# Altium project Engineering_project_DC_power_supply.PrjPcb
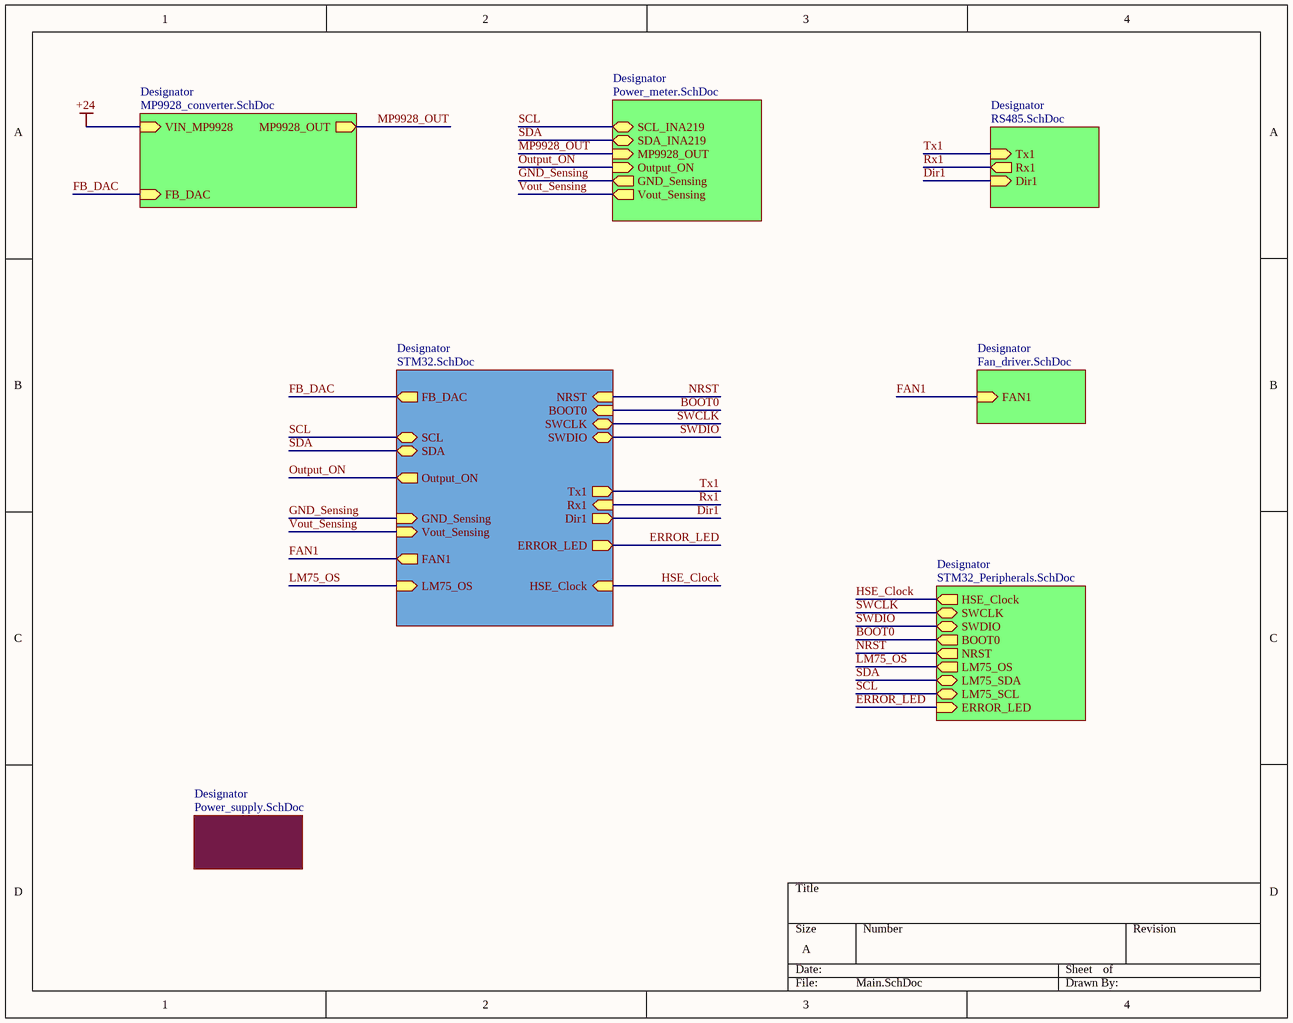
[diagram p0: Main.SchDoc]
8 sheets, 138 parts. Net scope: hierarchical (ports join the sheet entries above them; power ports are global).
Board file: PCB1.PcbDoc
Sheets:
  Main.SchDoc
    Designator = RS485.SchDoc
    Designator = Power_supply.SchDoc
    Designator = Fan_driver.SchDoc
    Designator = STM32_Peripherals.SchDoc
    Designator = Power_meter.SchDoc
    Designator = MP9928_converter.SchDoc
    Designator = STM32.SchDoc

## Sheet Main.SchDoc
size A; SheetNumber: 1; SheetTotal: 8

### Sub-sheets
Designator = RS485.SchDoc: Tx1 (in), Rx1 (out), Dir1 (in)
Designator = Power_supply.SchDoc: no entries
Designator = Fan_driver.SchDoc: FAN1 (in)
Designator = STM32_Peripherals.SchDoc: HSE_Clock (out), SWCLK (bidir), SWDIO (bidir), BOOT0 (out), NRST (out), LM75_OS (out), LM75_SDA (bidir), LM75_SCL (bidir), ERROR_LED (in)
Designator = Power_meter.SchDoc: SCL_INA219 (bidir), SDA_INA219 (bidir), MP9928_OUT (in), Output_ON (in), GND_Sensing (out), Vout_Sensing (out)
Designator = MP9928_converter.SchDoc: FB_DAC (in), MP9928_OUT (out), VIN_MP9928 (in)
Designator = STM32.SchDoc: NRST (in), BOOT0 (in), SWCLK (bidir), SWDIO (bidir), FB_DAC (out), SCL (bidir), SDA (bidir), Output_ON (out), GND_Sensing (in), Vout_Sensing (in), FAN1 (out), LM75_OS (in), HSE_Clock (in), ERROR_LED (out), Tx1 (out), Rx1 (in), Dir1 (out)

### Nets
BOOT0: sheet Designator/BOOT0, sheet Designator/BOOT0
Dir1: sheet Designator/Dir1, sheet Designator/Dir1
ERROR_LED: sheet Designator/ERROR_LED, sheet Designator/ERROR_LED
FAN1: sheet Designator/FAN1, sheet Designator/FAN1
FB_DAC: sheet Designator/FB_DAC, sheet Designator/FB_DAC
GND_Sensing: sheet Designator/GND_Sensing, sheet Designator/GND_Sensing
HSE_Clock: sheet Designator/HSE_Clock, sheet Designator/HSE_Clock
LM75_OS: sheet Designator/LM75_OS, sheet Designator/LM75_OS
MP9928_OUT: sheet Designator/MP9928_OUT, sheet Designator/MP9928_OUT
NRST: sheet Designator/NRST, sheet Designator/NRST
Output_ON: sheet Designator/Output_ON, sheet Designator/Output_ON
Rx1: sheet Designator/Rx1, sheet Designator/Rx1
SCL: sheet Designator/LM75_SCL, sheet Designator/SCL_INA219, sheet Designator/SCL
SDA: sheet Designator/LM75_SDA, sheet Designator/SDA_INA219, sheet Designator/SDA
SWCLK: sheet Designator/SWCLK, sheet Designator/SWCLK
SWDIO: sheet Designator/SWDIO, sheet Designator/SWDIO
Tx1: sheet Designator/Tx1, sheet Designator/Tx1
Vout_Sensing: sheet Designator/Vout_Sensing, sheet Designator/Vout_Sensing

## Sheet RS485.SchDoc
size A; SheetNumber: 2; SheetTotal: 8
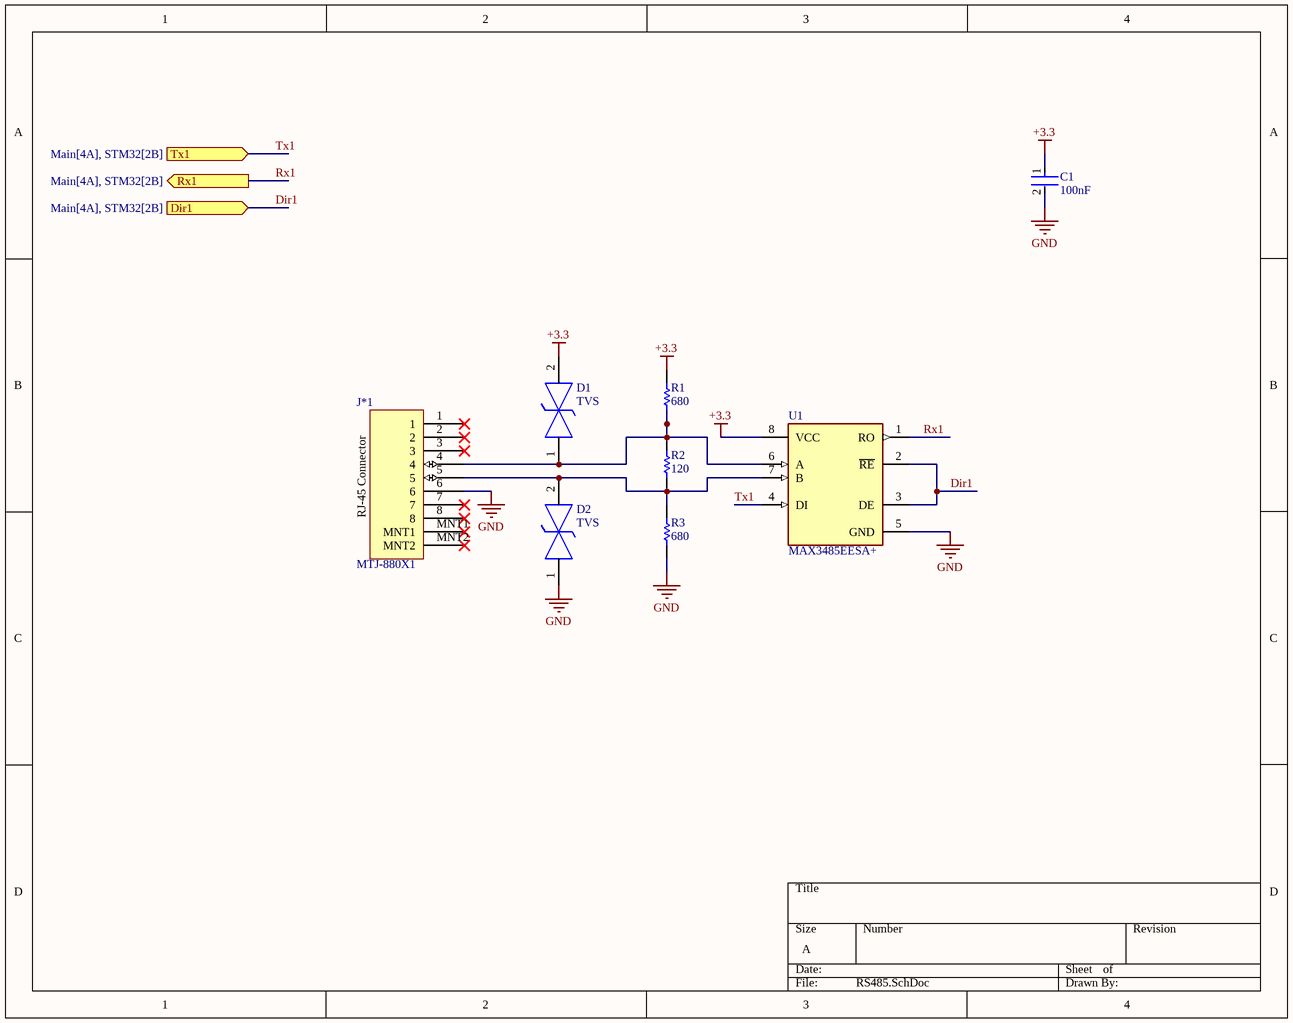
[diagram p1: RS485.SchDoc]

### Parts
C1  100nF  [FP-0805-L_2_01_0_2-W_1_25-IPC_B]
D1  TVS  [FP-SMB-MFG]
D2  TVS  [FP-SMB-MFG]
J*1  MTJ-880X1  [MTJ-880X1]
R1  680  [RESC2013X50X30LL20T20]
R2  120  [RESC2013X50X30LL20T20]
R3  680  [RESC2013X50X30LL20T20]
U1  MAX3485EESA+  [FP-S8-5-MFG]

### Ports
Dir1 (in, see Main[4A], STM32[2B]), Rx1 (out, see Main[4A], STM32[2B]), Tx1 (in, see Main[4A], STM32[2B])

### Nets
+3.3: C1.1 D1.2 R1.2 U1.8(VCC)
GND: C1.2 D2.1 J*1.6 R3.1 U1.5(GND)
Dir1: U1.2(~{RE}) U1.3(DE) ; port Dir1
Rx1: U1.1(RO) ; port Rx1
Tx1: U1.4(DI) ; port Tx1
NetD1_1: D1.1 J*1.4 R1.1 R2.2 U1.6(A)
NetD2_2: D2.2 J*1.5 R2.1 R3.2 U1.7(B)

Not connected (* = marked no-connect by the designer): J*1 1* 2* 3* 7* 8* MNT1* MNT2*

### Notes on the sheet
- (in symbol MTJ-880X1) RJ-45 Connector

### Library data of the parts
C1 = CMP-2007-04174-2: General Purpose Ceramic Capacitor, 0805, 100nF, 10%, X7R, 15%, 100V; Packaging: Tape and Reel; Min Operating Temperature: -55°C; Dielectric Material: Ceramic; Height: 1.4mm; Voltage Rating: 100V; Termination: SMD/SMT; Case Code (Imperial): 0805; Case Code (Metric): 2012; Case/Package: 0805; Construction: Flat; Radiation Hardening: No; Series: -; Dielectric: X7R; Package Quantity: 2000; Mount: Surface Mount; Capacitance: 100nF; Contact Plating: Tin; Voltage: 100V; Lead Free: Lead Free; Depth: 1.25mm; RoHS Compliant: Yes; Number of Pins: 2; Max Operating Temperature: 125°C; Length: 2.01mm; Voltage Rating (DC): 100V; Thickness: 0.055inch; REACH SVHC: No SVHC; Width: 0.049inch; Tolerance: 10%
D1 D2 = CMP-12225-000039-1: TVS DIODE 28.2V 59V SMB; Manufacturer Part Number: SM6T33CA; Manufacturer: STMicroelectronics; Max Junction Temp: +150°C; Standoff Height: 0.05mm; Direction: Bidirectional; Number Of Channels: 1; Reverse Standoff Voltage: 33V; Peak Pulse Current: 68A; Breakdown Voltage: 31.4V; Peak Pulse Power: 600W; Mouser Description: TVS Diodes - Transient Voltage Suppressors 600W 33V Bidirect; Device Class L1: Circuit Protection; Device Class L3: unset; Temperature Range Low: -55°C; Octopart: https://octopart.com/sm6t33ca-stmicroelectronics-55399331; Height: 2.65mm; Digikey Description: TVS DIODE 28.2V 59V SMB; Automotive: No; Category: Diode; Device Class L2: TVS Diodes; Temperature: -55°C to +150°C; ComponentLink2URL: https://www.st.com/resource/en/datasheet/sm6t.pdf; Lead Free: Yes; Clamping Voltage: 59V; RoHS: TRUE; Temperature Range High: +150°C; Package: SMB; ComponentLink2Description: Datasheet
R1-R3 = CMP-2001-04896-1: Manufacturer: Vishay Dale; Part Number: CRCW08050000Z0EA
U1 = CMP-05679-000038-1: IC TXRX RS485/422 10MBPS 8SOIC; Manufacturer: Maxim Integrated; Number Of Receivers: 1; Simplex Duplex: Half Duplex; Data Rate: 15Mbits/s; Interface: RS-485,RS-422; Max Supply Voltage: 3.6V; Nominal Supply Current: 0.95-1.1mA; Min Supply Voltage: 3V; Standoff Height: 0.1mm; Mouser Description: RS-422/RS-485 Interface IC 3.3V 12Mbps Transceiver; Lead Free: Yes; Footprint Url: https://pdfserv.maximintegrated.com/land_patterns/90-0096.PDF; Device Class L1: Integrated Circuits (ICs); Device Class L3: RS-232 / RS-422 / RS-485 Interface ICs; RoHS: TRUE; Height: 1.75mm; ComponentLink2URL: https://datasheets.maximintegrated.com/en/ds/MAX3483E-MAX3491E.pdf; Temperature Range High: +85°C; Temperature: -40°C to +85°C; Manufacturer Part Number: MAX3485EESA+; Number Of Transmitters: 1; Device Class L2: Interface ICs; Octopart: https://octopart.com/max3485eesa%2B-maxim+integrated-39731903; ComponentLink2Description: Datasheet; Category: IC; Digikey Description: IC TXRX RS485/422 10MBPS 8SOIC; Automotive: No; Temperature Range Low: -40°C; Package: S8-5

## Sheet Power_supply.SchDoc
size A; SheetNumber: 3; SheetTotal: 8
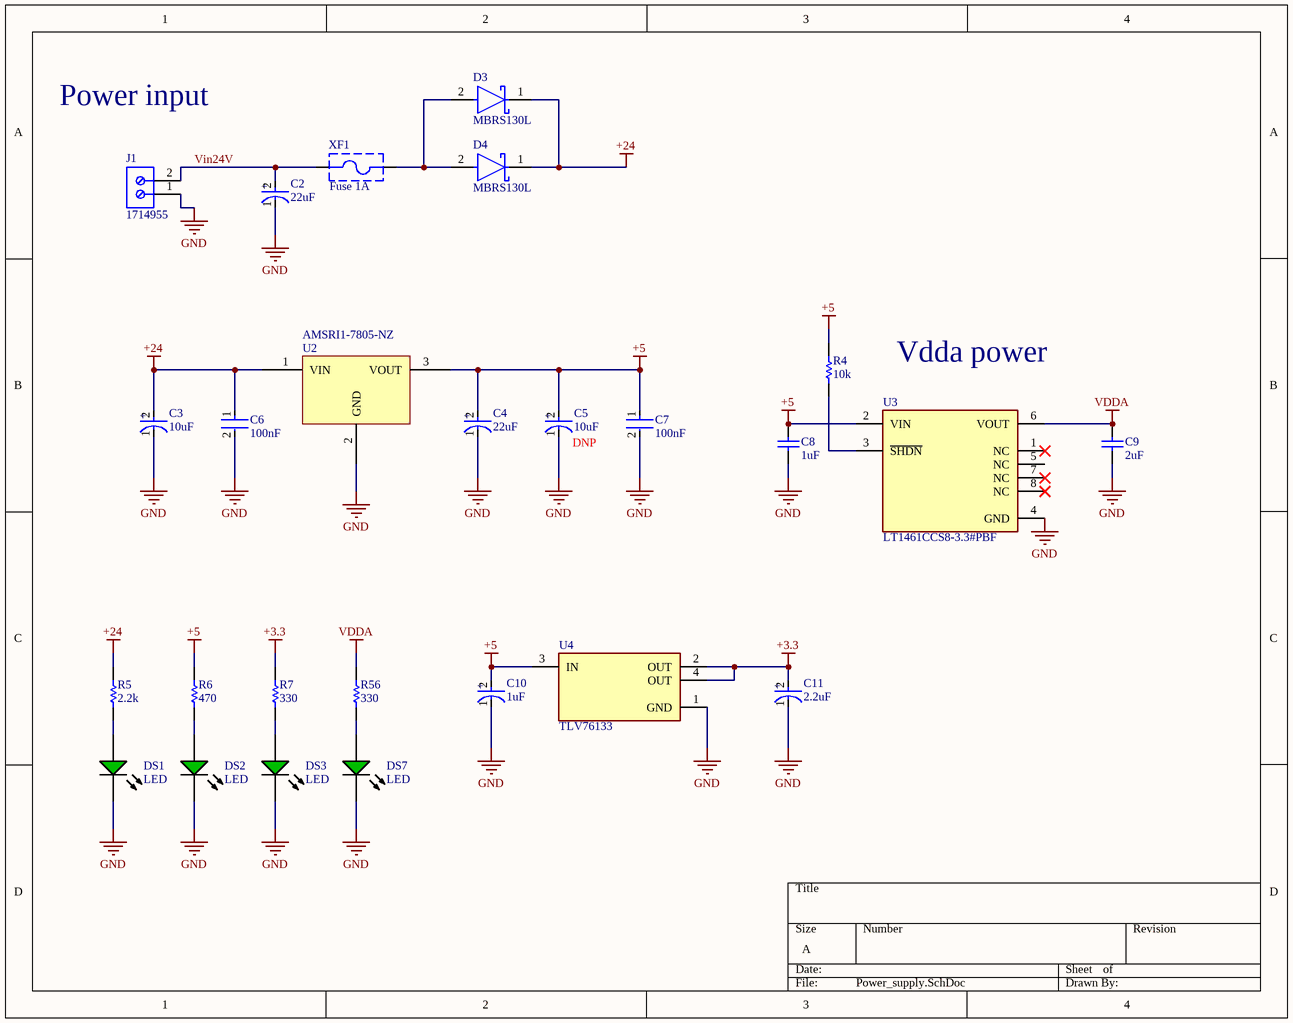
[diagram p2: Power_supply.SchDoc]

### Parts
C2  22uF  [FP-FCE-MFG]
C3  10uF  [FP-FKD-MFG]
C4  22uF  [FP-FCE-MFG]
C5  10uF  [FP-FKD-MFG]
C6  100nF  [FP-0805-L_2_01_0_2-W_1_25-IPC_B]
C7  100nF  [FP-0805-L_2_01_0_2-W_1_25-IPC_B]
C8  1uF  [CAPC2013X140X50LL20T25]
C9  2uF  [CAPC2013X140X50LL20T25]
C10  1uF  [FP-FKD-MFG]
C11  2.2uF  [FP-FKD-MFG]
D3  MBRS130L  [FP-403AF-MFG]
D4  MBRS130L  [FP-403AF-MFG]
DS1  LED  [AVAG-HSMX-C170_V]
DS2  LED  [AVAG-HSMX-C170_V]
DS3  LED  [AVAG-HSMX-C170_V]
DS7  LED  [AVAG-HSMX-C170_V]
J1  1714955  [PHOE-1714955_V]
R4  10k  [RESC2013X50X30LL20T20]
R5  2.2k  [RESC2013X50X30LL20T20]
R6  470  [RESC2013X50X30LL20T20]
R7  330  [RESC2013X50X30LL20T20]
R56  330  [RESC2013X50X30LL20T20]
U2  AMSRI1-7805-NZ  [SIP750W46P254L1400H1010Q3]
U3  LT1461CCS8-3.3#PBF  [FP-S8-8-05-08-1610-IPC_A]
U4  TLV76133  [FP-DCY0004A-MFG]
XF1  Fuse 1A  [696106003002]

### Nets
+3.3: C11.2(A) R7.2 U4.2(OUT) U4.4(OUT)
+5: C4.2(A) C5.2(A) C7.1 C8.2 C10.2(A) R4.2 R6.2 U2.3(VOUT) U3.2(VIN) U4.3(IN)
+24: C3.2(A) C6.1 D3.1(C) D4.1(C) R5.2 U2.1(VIN)  [project net VIN_MP9928]
GND: C2.1(C) C3.1(C) C4.1(C) C5.1(C) C6.2 C7.2 C8.1 C9.1 C10.1(C) C11.1(C) DS1.2(K) DS2.2(K) DS3.2(K) DS7.2(K) J1.1 U2.2(GND) U3.4(GND) U4.1(GND)
VDDA: C9.2 R56.2 U3.6(VOUT)
Vin24V: C2.2(A) J1.2 XF1.1
NetD3_2: D3.2(A) D4.2(A) XF1.2
NetDS1_1: DS1.1(A) R5.1
NetDS2_1: DS2.1(A) R6.1
NetDS3_1: DS3.1(A) R7.1
NetDS7_1: DS7.1(A) R56.1
NetR4_1: R4.1 U3.3(~{SHDN})

Not connected (* = marked no-connect by the designer): U3 1(NC)* 5(NC) 7(NC)* 8(NC)*

### Notes on the sheet
- Power input
- Vdda power
- (near C5) DNP
- (in symbol CMP-2000-06207-2) +
- (in symbol CMP-05427-002128-1) +

### Library data of the parts
C2 C4 = CMP-05427-002128-1: CAP ALUM 22UF 20% 50V SMD; Ripple Current: 120mA; Material: Aluminium; ESR (Equivalent Series Resistance): 700mR; Polarity: Polar; Lead Length: 3.4mm; Leakage Current: 3uA; Life (Hours): 1000Hour; Diameter: 8mm; RoHS Compliant: Yes; Voltage Rating: 50V; Reach SVHC Compliant: Yes; Series: FC; Capacitance: 22uF; Ripple Current (AC): 120mA; Mount: Surface Mount; Min Operating Temperature: -40°C; Max Operating Temperature: 105°C; Radiation Hardening: No; Contact Plating: Tin; Impedance: 700mR; Construction: Cylindrical; Height - Seated (Max): 0.244inch; Packaging: Tape and Reel; Dielectric Material: Aluminium; Voltage: 50V; Voltage Rating (DC): 50V; Height: 6.2mm; Package Quantity: 1000; Length: 6.5mm; Lead Pitch: 2.2mm; Width: 8.3mm; Termination: SMD/SMT; Case/Package: Radial; Tolerance: 20%; Number of Pins: 2; Lead Free: Lead Free
C3 C5 C10 C11 = CMP-2000-06207-2: CAP ALUM 10UF 20% 50V SMD; Impedance: 880mR; Ripple Current: 165mA; Polarity: Polar; Leakage Current: 3uA; Lead Diameter: 0.65mm; Life (Hours): 2000Hour; REACH SVHC: No SVHC; Series: FK; Max Operating Temperature: 105°C; Radiation Hardening: No; Size: 5.8mm; Ripple Current (AC): 165mA; Lead Free: Lead Free; Voltage: 50V; Contact Plating: Tin; Case/Package: Radial; RoHS Compliant: Yes; Voltage Rating: 50V; Height - Seated (Max): 0.24inch; Package Quantity: 1000; Termination: SMD/SMT; Number of Pins: 2; Mount: Surface Mount; Packaging: Tape and Reel; Length: 5.8mm; Width: 7.8mm; Min Operating Temperature: -55°C; Height: 5.8mm; ESR (Equivalent Series Resistance): 880mR; Capacitance: 10uF; Diameter: 6.3mm; Voltage Rating (DC): 50V; Construction: Cylindrical; Tolerance: 20%; Lead Pitch: 1.8mm
C6 C7 = CMP-2007-04174-2: General Purpose Ceramic Capacitor, 0805, 10nF, 10%, X7R, 15%, 100V; Packaging: Tape and Reel; Min Operating Temperature: -55°C; Dielectric Material: Ceramic; Height: 1.4mm; Voltage Rating: 100V; Termination: SMD/SMT; Case Code (Imperial): 0805; Case Code (Metric): 2012; Case/Package: 0805; Construction: Flat; Radiation Hardening: No; Series: -; Dielectric: X7R; Package Quantity: 2000; Mount: Surface Mount; Capacitance: 100nF; Contact Plating: Tin; Voltage: 100V; Lead Free: Lead Free; Depth: 1.25mm; RoHS Compliant: Yes; Number of Pins: 2; Max Operating Temperature: 125°C; Length: 2.01mm; Voltage Rating (DC): 100V; Thickness: 0.055inch; REACH SVHC: No SVHC; Width: 0.049inch; Tolerance: 10%
C8 C9 = CMP-2007-03234-1: Part Number: C0805C105K3RACTU; Manufacturer: Kemet
D3 D4 = CMP-00278-20916186-1: MBRS130L Rectifier Diode, Schottky, 1 Phase, 1 Element, 2A, 30V V(RRM), Silicon, DO-214AA; Manufacturer Lifecycle Status: OBSOLETE; Output Current: 1A; Forward Voltage: 445mV; Peak Reverse Current: 1mA; Max Surge Current: 40A; Polarity: Standard; Element Configuration: Single; Max Junction Temperature (Tj): 125°C; Lead Free: Lead Free; Packaging: Cut Tape; Mount: Surface Mount; Max Repetitive Reverse Voltage (Vrrm): 30V; Forward Current: 2A; Length: 4.75mm; Weight: 180mg; Radiation Hardening: No; Max Operating Temperature: 125°C; Schedule B: 8541100080; Peak Non-Repetitive Surge Current: 40A; Height: 2.45mm; Case/Package: SMB; Min Operating Temperature: -65°C; Average Rectified Current: 2A; Lifecycle Status: Obsolete; REACH SVHC: No SVHC; Voltage Rating (DC): 30V; Max Forward Surge Current (Ifsm): 40A; NexarPartId: 20916186; Max Reverse Leakage Current: 1mA; Number of Pins: 2; Width: 3.95mm; RoHS: Compliant; Max Reverse Voltage (DC): 30V; Current Rating: 1A
DS1-DS3 DS7 = CMP-2000-05062-1: Chip LED, Green, 2.2 V, -40 to 85 degC, 2-Pin SMD, Pb-Free, Tape and Reel; Manufacturer: Avago; No. of Pins: 2; Peak Wavelength: 570nm; SVHC: NoSVHC(16-Jun-2014); Dominant Wavelength: 572nm; Forward Current If: 20mA; Viewing Angle: 170deg; Lens Shape: Rectangular; PIV Max: 5V; External Width: 1.25mm; LED Type: Standard; External Depth: 0.8mm; Opto Mounting Orientation: Top; Luminous Intensity: 15mcd; Luminous Intensity Min: 4mcd; Forward Voltage VF Max: 2.6V; External Length / Height: 2mm; Bulb Size: 1.25mmx1.4mm; Light Area Height: 1mm; Voltage Vf Typ: 2.2V; Operating Temperature Max: 85degC; Datasheet Version: Oct-08; MSL: MSL2A-4weeks; Peak Forward Current: 20mA; Package Description: 2-Pin Surface Mount Device, Body 2 x 1.25 mm, Height 0.8 mm; Datasheet URL: https://datasheet.ciiva.com/29280/180495-da-01-en-chip-led-hsmg-c170-gelb-gruen-29280971.pdf; Storage Temperature Min: -40degC; LED Colour: Green; Wavelength Typ: 570nm; Mounting Type: SMD; Forward Current If Max: 20mA; Dominant Wavelength Typ: 572nm; LED Mounting: SMD; Operating Temperature Range: -30degCto+85degC; Operating Temperature Min: -30degC; Manufacturer URL: http://www.avagotech.com/; Packaging: CutTape; Luminous Intensity Typ: 15mcd; Package Reference: HSMX-C170; Storage Temperature Max: 85degC; Opto Case Style: SMD; Forward Voltage: 2.2V
J1 = CMP-2000-05797-1: PC Terminal Block, Pitch 6.35 mm, 1 x 2 Position, Height 21.5 mm, Tail Lenght 5.1 mm, RoHS, Bulk; Manufacturer: Phoenix Contact; Package Description: PC Terminal Block, Pitch 6.35 mm, 1 x 2 Position, Height 21.5 mm, Tail Lenght 5.1 mm; Datasheet URL: http://media.digikey.com/pdf/Data%20Sheets/Phoenix%20Contact%20PDFs/1714955.pdf; Package Reference: 1714955; Manufacturer URL: http://www.phoenixcontact.com/; Datasheet Version: 02/2010; Mounting Technology: ThroughHole
R4-R7 R56 = CMP-2001-04896-1: as R1 on sheet RS485
U2 = AMSRI1-7805-NZ: AMSRI1-7805-NZ, 5V / 1A DC output converter
U3 = CMP-09137-000077-1: IC VREF SERIES 0.08% 8SOIC; Output Type: Fixed; Max Output Current: 100mA; Reference Voltage: 3.3V; Quiescent Current: 50uA; Operating Supply Current: 70uA; Temperature Coefficient: 12ppm/°C; Max Input Voltage: 20V; Output Current: 100mA; Max Operating Temperature: 70°C; Width: 3.988mm; Series: -; REACH SVHC: No SVHC; RoHS Compliant: Yes; Length: 5mm; Case/Package: SOIC; Output Voltage: 3.3V; Mount: Surface Mount; Reference Type: Series; Package Quantity: 100; Min Output Voltage: 3.3V; Height: 1.498mm; Max Output Voltage: 3.3V; Min Operating Temperature: 0°C; Number of Pins: 8; Lead Free: Lead Free; Tolerance: 0.08%; Packaging: Rail/Tube
U4 = CMP-00370-134324849-1: TLV76133 1-A 16-V high-PSRR linear voltage regulator 4-SOT-223 -40 to 125; Manufacturer Lifecycle Status: ACTIVE; Number of Channels: 1; Min Supply Voltage: 6.5V; Nominal Supply Current: 65µA; Dropout Voltage: 900mV; Accuracy: 1%; Max Supply Voltage: 16V; Max Junction Temperature (Tj): 125°C; Output Current: 1A; Output Voltage: 5V; Width: 3.5mm; Length: 6.5mm; NexarPartId: 134324849; Max Operating Temperature: 125°C; Thickness: 1.6mm; Min Operating Temperature: -40°C; Case/Package: SOT-223; Height: 1.8mm; Lifecycle Status: Production; Number of Pins: 4; Number of Outputs: 1
XF1 = CMP-1502-00235-2: NexarPartId: 56808805; Fuse Current: 10A; Voltage Rating (AC): 250V; RoHS: Non-Compliant; Min Operating Temperature: -30°C; Height: 11.6mm; Packaging: Box; Mount: Through Hole; REACH SVHC: Unknown; Max Operating Temperature: 120°C

## Sheet Fan_driver.SchDoc
size A; SheetNumber: 7; SheetTotal: 8
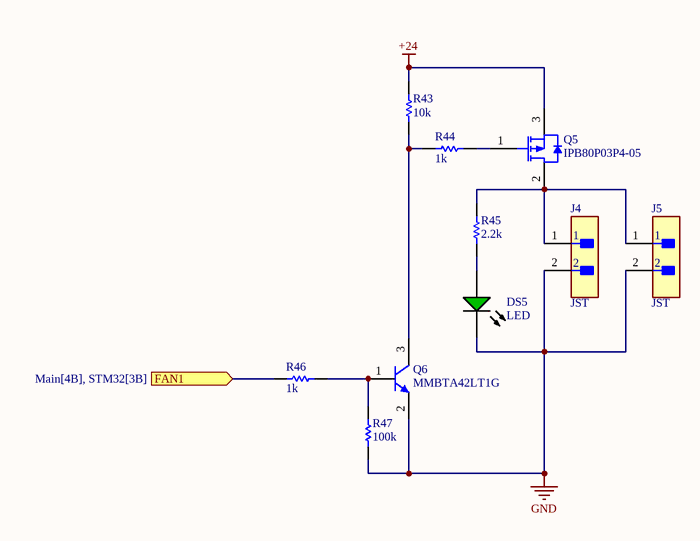
[diagram p3: Fan_driver.SchDoc]

### Parts
DS5  LED  [AVAG-HSMX-C170_V]
J4  JST  [FP-B2B-EH-A_LF_SN-MFG]
J5  JST  [FP-B2B-EH-A_LF_SN-MFG]
Q5  IPB80P03P4-05  [INF-PG-TO263-3-2_N]
Q6  MMBTA42LT1G  [ONSC-SOT-23-3-318-08_V]
R43  10k  [RESC2013X50X30LL20T20]
R44  1k  [RESC2013X50X30LL20T20]
R45  2.2k  [RESC2013X50X30LL20T20]
R46  1k  [RESC2013X50X30LL20T20]
R47  100k  [RESC2013X50X30LL20T20]

### Ports
FAN1 (in, see Main[4B], STM32[3B])

### Nets
+24: Q5.3(SOURCE) R43.2  [project net VIN_MP9928]
GND: DS5.2(K) J4.2 J5.2 Q6.2(E) R47.1
FAN1: R46.1 ; port FAN1
NetDS5_1: DS5.1(A) R45.1
NetJ4_1: J4.1 J5.1 Q5.2(DRAIN) R45.2
NetQ5_1: Q5.1(GATE) R44.2
NetQ6_1: Q6.1(B) R46.2 R47.2
NetQ6_3: Q6.3(C) R43.1 R44.1

### Library data of the parts
DS5 = CMP-2000-05062-1: as DS1 on sheet Power_supply; Operating Temperature Max: 85degC; Datasheet Version: Oct-08; MSL: MSL2A-4weeks; Peak Forward Current: 20mA; Package Description: 2-Pin Surface Mount Device, Body 2 x 1.25 mm, Height 0.8 mm; Datasheet URL: https://datasheet.ciiva.com/29280/180495-da-01-en-chip-led-hsmg-c170-gelb-gruen-29280971.pdf; Storage Temperature Min: -40degC; LED Colour: Green; Wavelength Typ: 570nm; Mounting Type: SMD; Forward Current If Max: 20mA; Dominant Wavelength Typ: 572nm; LED Mounting: SMD; Operating Temperature Range: -30degCto+85degC; Operating Temperature Min: -30degC; Manufacturer URL: http://www.avagotech.com/; Packaging: CutTape; Luminous Intensity Typ: 15mcd; Package Reference: HSMX-C170; Storage Temperature Max: 85degC; Opto Case Style: SMD; Forward Voltage: 2.2V
J4 J5 = CMP-17439-000026-1: CONN HEADER VERT 2POS 2.5MM; Number of Contacts: 2; Current Rating: 3A; Connector Type: Plug; Contact Resistance: 20mR; Gender: Male; Voltage Rating: 250V; Fastening Type: Detent; Depth: 3.8mm; Max Operating Temperature: 85°C; Orientation: Straight; Series: EH; Contact Plating: Tin; Min Operating Temperature: -25°C; Contact Type: Male Pin; Housing Color: White; Termination: Press-Fit; Housing Material: Nylon; Pitch: 2.5mm; Number of Positions: 2; Max Current Rating: 3A; Packaging: Bulk; Lead Free: Lead Free; Number of Rows: 1; Length: 7.5mm; Contact Mating Length: 0.13inch; Color: Natural; Max Voltage Rating (AC): 250V; Contact Material: Copper Alloy; Mount: Through Hole
Q5 = CMP-1138-00228-1: OptiMOS-P2 Power-Transistor, -30 V VDS, -80 A ID, PG-TO263-3-2, Reel, Green; Manufacturer: Infineon; Green: TRUE; RthJC (max): 1.1 K/W; RDS (on) (max) (@10V): 4.7 mOhm; VGS(th) (max): -4 V; QG: 100 nC; ID (max): -80 A; IDpuls (max): -320 A; VDS (max): -30 V; Ptot (max): 137 W; VGS(th) (min): -2 V; DatasheetVersion: Rev. 1.0; PackageReference: PG-TO263-3-2; ComponentLink1Description: Manufacturer URL; Mounting Technology: Surface Mount; PackageDescription: 3-Pin Plastic (Green) Transistor Single Outline Package, 10 x 9.25 mm Body, 2.54 mm Pitch; ComponentLink2URL: http://www.infineon.com/dgdl/IPP_B_I80P03P4-05_DS_10.pdf?folderId=db3a304314dca3890114ef902baa05f9&fileId=db3a30431ddc9372011e07ef59f52807&location=en.Products.Automotive_ICs.Automotive_MOSFETs.Single__P-Channel_30V_MOSFETs.DATASHEET.IPP_B_I80P03P4-05_DS_1; ComponentLink3Description: Package Specification; ComponentLink2Description: Datasheet; ComponentLink3URL: http://www.infineon.com/dgdl/BTS141TC_DS_10.pdf?folderId=db3a3043163797a6011667aa084c0e01&fileId=db3a3043242ebc9e01242f43f58b003e&location=en.Products.Automotive_ICs.Smart_High-_and_Low-Side_Switches.HITFET___TEMPFET__-_Smart_Low-Side_Switches.DATASHEET.BT; Halogen-free: TRUE; Technology: OptiMOS-P2; Packing: Reel; PartNumber: IPB80P03P4-05; ComponentLink1URL: http://www.infineon.com/; PackageVersion: Jul-09
Q6 = CMP-1048-00662-1: High Voltage Transistor, NPN Silicon, 3-Pin SOT-23, Pb-Free, Tape and Reel; Manufacturer: On Semiconductor; fT Min (MHz): 50; IC Continuous (A): 0.5; ComponentLink1URL: http://www.onsemi.com/; ComponentLink3URL: http://www.onsemi.cn/pub_link/Collateral/318-08.PDF; RoHS: TRUE; ComponentLink2Description: Datasheet; PartNumber: MMBTA42LT1G; Polarity: NPN; DatasheetVersion: Rev. 12; PackageReference: SOT-23-3-318-08; PackageDescription: 3-Pin Small Outline Transistor, Body 2.92 x 1.3 mm, Pitch 0.95 mm; ComponentLink3Description: Package Specification; ComponentLink1Description: Manufacturer URL; Packing: Tape and Reel; PackageVersion: Rev. AP, 11/2009; Mounting Technology: Surface Mount; ComponentLink2URL: http://www.onsemi.cn/pub_link/Collateral/MMBTA42LT1-D.PDF
R43-R47 = CMP-2001-04896-1: as R1 on sheet RS485

## Sheet STM32_Peripherals.SchDoc
size A; SheetNumber: 8; SheetTotal: 8
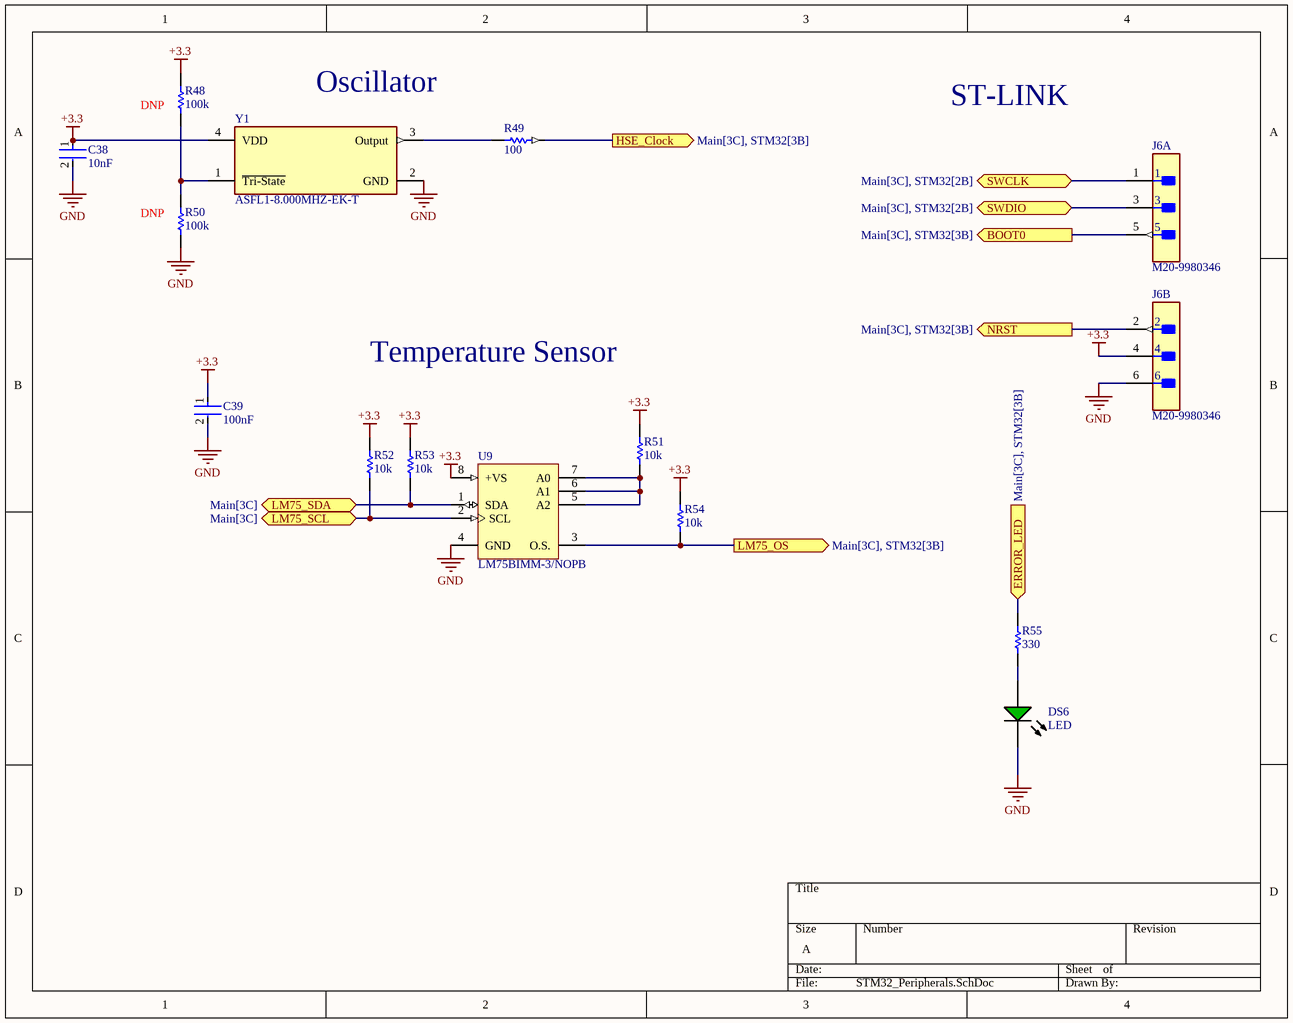
[diagram p4: STM32_Peripherals.SchDoc]

### Parts
C38  10nF  [FP-0805-L_2_01_0_2-W_1_25-IPC_B]
C39  100nF  [FP-0805-L_2_01_0_2-W_1_25-IPC_B]
DS6  LED  [AVAG-HSMX-C170_V]
J6  M20-9980346  [FP-M20-9980346-MFG]  (parts A,B of 2)
R48  100k  [RESC2013X50X30LL20T20]
R49  100  [RESC2013X50X30LL20T20]
R50  100k  [RESC2013X50X30LL20T20]
R51  10k  [RESC2013X50X30LL20T20]
R52  10k  [RESC2013X50X30LL20T20]
R53  10k  [RESC2013X50X30LL20T20]
R54  10k  [RESC2013X50X30LL20T20]
R55  330  [RESC2013X50X30LL20T20]
U9  LM75BIMM-3/NOPB  [DGK0008A_L]
Y1  ASFL1-8.000MHZ-EK-T  [FP-ASFL1-MFG]

### Ports
BOOT0 (out, see Main[3C], STM32[3B]), ERROR_LED (in, see Main[3C], STM32[3B]), HSE_Clock (out, see Main[3C], STM32[3B]), LM75_OS (out, see Main[3C], STM32[3B]), LM75_SCL (bidir, see Main[3C]), LM75_SDA (bidir, see Main[3C]), NRST (out, see Main[3C], STM32[3B]), SWCLK (bidir, see Main[3C], STM32[2B]), SWDIO (bidir, see Main[3C], STM32[2B])

### Nets
+3.3: C38.1 C39.1 J6.4 R48.2 R51.2 R52.2 R53.2 R54.2 U9.8(+VS) Y1.4(VDD)
GND: C38.2 C39.2 DS6.2(K) J6.6 R50.1 U9.4(GND) Y1.2(GND)
BOOT0: J6.5 ; port BOOT0
ERROR_LED: R55.2 ; port ERROR_LED
HSE_Clock: R49.2 ; port HSE_Clock
LM75_OS: R54.1 U9.3(O.S.) ; port LM75_OS
NRST: J6.2 ; port NRST
SCL: R52.1 U9.2(SCL) ; port LM75_SCL
SDA: R53.1 U9.1(SDA) ; port LM75_SDA
SWCLK: J6.1 ; port SWCLK
SWDIO: J6.3 ; port SWDIO
NetDS6_1: DS6.1(A) R55.1
NetR48_1: R48.1 R50.2 Y1.1(~{Tri-State})
NetR49_1: R49.1 Y1.3(Output)
NetR51_1: R51.1 U9.5(A2) U9.6(A1) U9.7(A0)

### Notes on the sheet
- Oscillator
- (near R48) DNP
- ST-LINK
- (near R50) DNP
- Temperature Sensor

### Library data of the parts
C38 = CMP-2007-04174-2: General Purpose Ceramic Capacitor, 0805, 10nF, 10%, X7R, 15%, 100V; Capacitance: 100nF; Packaging: Tape and Reel; Min Operating Temperature: -55°C; Dielectric Material: Ceramic; Height: 1.4mm; Voltage Rating: 100V; Termination: SMD/SMT; Case Code (Imperial): 0805; Case Code (Metric): 2012; Case/Package: 0805; Construction: Flat; Radiation Hardening: No; Series: -; Dielectric: X7R; Package Quantity: 2000; Mount: Surface Mount; Contact Plating: Tin; Voltage: 100V; Lead Free: Lead Free; Depth: 1.25mm; RoHS Compliant: Yes; Number of Pins: 2; Max Operating Temperature: 125°C; Length: 2.01mm; Voltage Rating (DC): 100V; Thickness: 0.055inch; REACH SVHC: No SVHC; Width: 0.049inch; Tolerance: 10%
C39 = CMP-2007-04174-2: as C1 on sheet RS485; Packaging: Tape and Reel; Min Operating Temperature: -55°C; Dielectric Material: Ceramic; Height: 1.4mm; Voltage Rating: 100V; Termination: SMD/SMT; Case Code (Imperial): 0805; Case Code (Metric): 2012; Case/Package: 0805; Construction: Flat; Radiation Hardening: No; Series: -; Dielectric: X7R; Package Quantity: 2000; Mount: Surface Mount; Capacitance: 100nF; Contact Plating: Tin; Voltage: 100V; Lead Free: Lead Free; Depth: 1.25mm; RoHS Compliant: Yes; Number of Pins: 2; Max Operating Temperature: 125°C; Length: 2.01mm; Voltage Rating (DC): 100V; Thickness: 0.055inch; REACH SVHC: No SVHC; Width: 0.049inch; Tolerance: 10%
DS6 = CMP-2000-05062-1: as DS1 on sheet Power_supply; Operating Temperature Max: 85degC; Datasheet Version: Oct-08; MSL: MSL2A-4weeks; Peak Forward Current: 20mA; Package Description: 2-Pin Surface Mount Device, Body 2 x 1.25 mm, Height 0.8 mm; Datasheet URL: https://datasheet.ciiva.com/29280/180495-da-01-en-chip-led-hsmg-c170-gelb-gruen-29280971.pdf; Storage Temperature Min: -40degC; LED Colour: Green; Wavelength Typ: 570nm; Mounting Type: SMD; Forward Current If Max: 20mA; Dominant Wavelength Typ: 572nm; LED Mounting: SMD; Operating Temperature Range: -30degCto+85degC; Operating Temperature Min: -30degC; Manufacturer URL: http://www.avagotech.com/; Packaging: CutTape; Luminous Intensity Typ: 15mcd; Package Reference: HSMX-C170; Storage Temperature Max: 85degC; Opto Case Style: SMD; Forward Voltage: 2.2V
J6 = CMP-2000-06636-2: CONN HEADER VERT 6POS 2.54MM; Manufacturer: Harwin; Current Rating: 3A; Number Of Contacts: 6; Conn Gender: Male; Conn Orientation: Vertical; Device Class L1: Connectors; ComponentLink2Description: Datasheet; Height: 8.99mm; Temperature Range High: +105°C; Contact Material: Tin,Nickel; RoHS: TRUE; Temperature Range Low: -40°C; ComponentLink2URL: https://cdn.harwin.com/pdfs/M20-998.pdf; Digikey Description: CONN HEADER VERT 6POS 2.54MM; Pitch: 2.54mm; Package: M20-9980346; Device Class L2: Headers and Wire Housings; Manufacturer Part Number: M20-9980346; Number Of Rows: 2; Category: Conn; Lead Free: Yes; Mouser Description: 2.54mm (0.1") Pitch DIL Vertical PC Tail Pin Header, 6.1mm mating pin height, tin, 3+3 contacts; Temperature: -40°C to +105°C; Device Class L3: unset; Octopart: https://octopart.com/m20-9980346-harwin-5436545; Automotive: No
R48-R55 = CMP-2001-04896-1: as R1 on sheet RS485
U9 = CMP-0066-00336-3: Digital Temperature Sensor and Thermal Watchdog with Two-Wire Interface, 8-pin Mini SOIC, Pb-Free; Manufacturer: Texas Instruments; CompType: Temp Sensor IC; PackageTopMarking: ZXTT*T01B; PowerWise: N; RoHS: Y; ComponentLink1URL: http://www.ti.com/general/docs/lit/getliterature.tsp?genericPartNumber=LM75B&fileType=pdf; PackageDescription: MINI SOIC, .118 x .118 x .034in, 8 Lead, .0256in Pitch; Code_JEDEC: MO-187-AA; PinCount: 8; ComponentLink1Description: Datasheet URL; PackageReference: DGK0008A
Y1 = CMP-27762-013261-1: XTAL Oscillator 8MHz ±30ppm HCMOS, TTL 3.3V 4-SMD 5mm x 3.2mm; Min Supply Voltage: 2.97V; Load Capacitance: 15pF; Max Supply Voltage: 3.63V; Max Supply Current: 15mA; Radiation Hardening: No; Termination: SMD/SMT; Max Operating Temperature: 70°C; Frequency Stability: 30ppm; Series: ASFL1; Package Quantity: 1000; Mount: Surface Mount; Packaging: Tape and Reel; Length: 5mm; Case/Package: SMD/SMT; Lead Free: Lead Free; Operating Supply Voltage: 3.3V; Height: 0.051inch; Frequency: 8MHz; Number of Pins: 4; Depth: 3.2mm; Operating Frequency: 8 MHz; Width: 0.126inch; Min Operating Temperature: -20°C

## Sheet Power_meter.SchDoc
size A; SheetNumber: 5; SheetTotal: 8
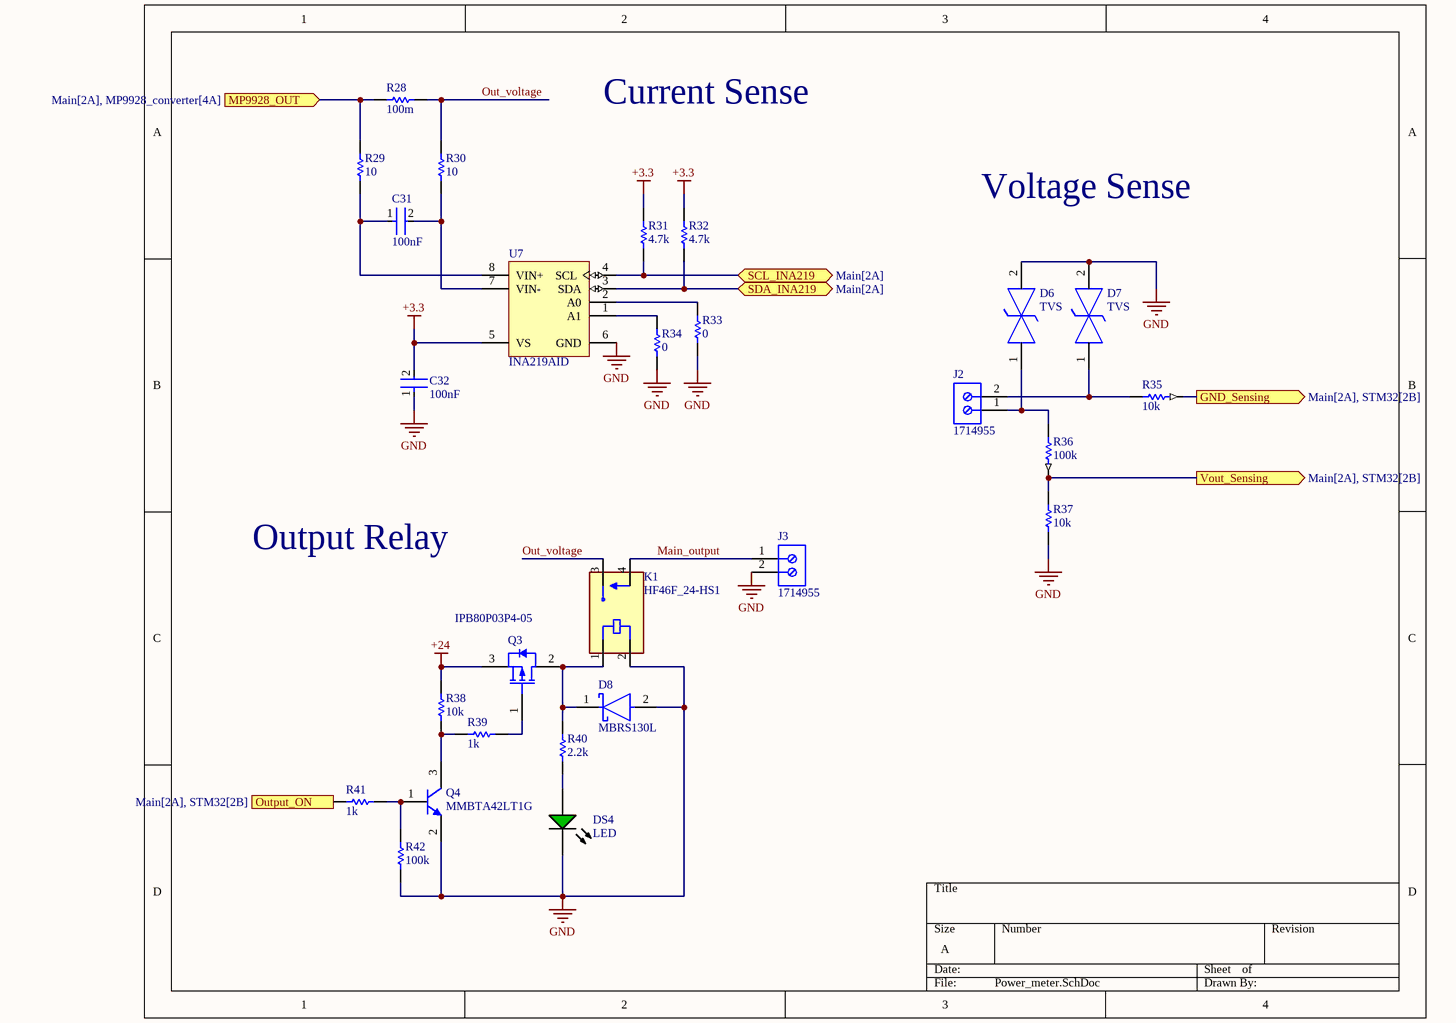
[diagram p5: Power_meter.SchDoc]

### Parts
C31  100nF  [FP-0805-L_2_01_0_2-W_1_25-IPC_B]
C32  100nF  [FP-0805-L_2_01_0_2-W_1_25-IPC_B]
D6  TVS  [FP-SMB-MFG]
D7  TVS  [FP-SMB-MFG]
D8  MBRS130L  [FP-403AF-MFG]
DS4  LED  [AVAG-HSMX-C170_V]
J2  1714955  [PHOE-1714955_V]
J3  1714955  [PHOE-1714955_V]
K1  HF46F_24-HS1  [RELAY_HF46F_005-HS1]
Q3  IPB80P03P4-05  [INF-PG-TO263-3-2_N]
Q4  MMBTA42LT1G  [ONSC-SOT-23-3-318-08_V]
R28  100m  [RESC3216X70X50NL05T20]
R29  10  [RESC2013X50X30LL20T20]
R30  10  [RESC2013X50X30LL20T20]
R31  4.7k  [RESC2013X50X30LL20T20]
R32  4.7k  [RESC2013X50X30LL20T20]
R33  0  [RESC2013X50X30LL20T20]
R34  0  [RESC2013X50X30LL20T20]
R35  10k  [RESC2013X50X30LL20T20]
R36  100k  [RESC2013X50X30LL20T20]
R37  10k  [RESC2013X50X30LL20T20]
R38  10k  [RESC2013X50X30LL20T20]
R39  1k  [RESC2013X50X30LL20T20]
R40  2.2k  [RESC2013X50X30LL20T20]
R41  1k  [RESC2013X50X30LL20T20]
R42  100k  [RESC2013X50X30LL20T20]
U7  INA219AID  [D0008A_N]

### Ports
GND_Sensing (out, see Main[2A], STM32[2B]), MP9928_OUT (in, see Main[2A], MP9928_converter[4A]), Output_ON (in, see Main[2A], STM32[2B]), SCL_INA219 (bidir, see Main[2A]), SDA_INA219 (bidir, see Main[2A]), Vout_Sensing (out, see Main[2A], STM32[2B])

### Nets
+3.3: C32.2 R31.2 R32.2 U7.5(VS)
+24: Q3.3(SOURCE) R38.2  [project net VIN_MP9928]
GND: C32.1 D6.2 D7.2 D8.2(A) DS4.2(K) J3.2 K1.2(COIL2) Q4.2(E) R33.1 R34.1 R37.2 R42.1 U7.6(GND)
GND_Sensing: R35.1 ; port GND_Sensing
Main_output: J3.1 K1.4(NO)
MP9928_OUT: R28.1 R29.2 ; port MP9928_OUT
Out_voltage: K1.3(COM) R28.2 R30.2
Output_ON: R41.1 ; port Output_ON
SCL: R31.1 U7.4(SCL) ; port SCL_INA219
SDA: R32.1 U7.3(SDA) ; port SDA_INA219
Vout_Sensing: R36.2 R37.1 ; port Vout_Sensing
NetC31_1: C31.1 R29.1 U7.8(VIN+)
NetC31_2: C31.2 R30.1 U7.7(VIN-)
NetD6_1: D6.1 J2.1 R36.1
NetD7_1: D7.1 J2.2 R35.2
NetD8_1: D8.1(C) K1.1(COIL1) Q3.2(DRAIN) R40.2
NetDS4_1: DS4.1(A) R40.1
NetQ3_1: Q3.1(GATE) R39.2
NetQ4_1: Q4.1(B) R41.2 R42.2
NetQ4_3: Q4.3(C) R38.1 R39.1
NetR33_2: R33.2 U7.2(A0)
NetR34_2: R34.2 U7.1(A1)

### Notes on the sheet
- Current Sense
- Voltage Sense
- Output Relay

### Library data of the parts
C31 C32 = CMP-2007-04174-2: as C1 on sheet RS485; Packaging: Tape and Reel; Min Operating Temperature: -55°C; Dielectric Material: Ceramic; Height: 1.4mm; Voltage Rating: 100V; Termination: SMD/SMT; Case Code (Imperial): 0805; Case Code (Metric): 2012; Case/Package: 0805; Construction: Flat; Radiation Hardening: No; Series: -; Dielectric: X7R; Package Quantity: 2000; Mount: Surface Mount; Capacitance: 100nF; Contact Plating: Tin; Voltage: 100V; Lead Free: Lead Free; Depth: 1.25mm; RoHS Compliant: Yes; Number of Pins: 2; Max Operating Temperature: 125°C; Length: 2.01mm; Voltage Rating (DC): 100V; Thickness: 0.055inch; REACH SVHC: No SVHC; Width: 0.049inch; Tolerance: 10%
D6 D7 = CMP-12225-000039-1: as D1 on sheet RS485; Mouser Description: TVS Diodes - Transient Voltage Suppressors 600W 33V Bidirect; Device Class L1: Circuit Protection; Device Class L3: unset; Temperature Range Low: -55°C; Octopart: https://octopart.com/sm6t33ca-stmicroelectronics-55399331; Height: 2.65mm; Digikey Description: TVS DIODE 28.2V 59V SMB; Automotive: No; Category: Diode; Device Class L2: TVS Diodes; Temperature: -55°C to +150°C; ComponentLink2URL: https://www.st.com/resource/en/datasheet/sm6t.pdf; Lead Free: Yes; Clamping Voltage: 59V; RoHS: TRUE; Temperature Range High: +150°C; Package: SMB; ComponentLink2Description: Datasheet
D8 = CMP-00278-20916186-1: as D3 on sheet Power_supply; Lead Free: Lead Free; Packaging: Cut Tape; Mount: Surface Mount; Max Repetitive Reverse Voltage (Vrrm): 30V; Forward Current: 2A; Length: 4.75mm; Weight: 180mg; Radiation Hardening: No; Max Operating Temperature: 125°C; Schedule B: 8541100080; Peak Non-Repetitive Surge Current: 40A; Height: 2.45mm; Case/Package: SMB; Min Operating Temperature: -65°C; Average Rectified Current: 2A; Lifecycle Status: Obsolete; REACH SVHC: No SVHC; Voltage Rating (DC): 30V; Max Forward Surge Current (Ifsm): 40A; NexarPartId: 20916186; Max Reverse Leakage Current: 1mA; Number of Pins: 2; Width: 3.95mm; RoHS: Compliant; Max Reverse Voltage (DC): 30V; Current Rating: 1A
DS4 = CMP-2000-05062-1: as DS1 on sheet Power_supply; Operating Temperature Max: 85degC; Datasheet Version: Oct-08; MSL: MSL2A-4weeks; Peak Forward Current: 20mA; Package Description: 2-Pin Surface Mount Device, Body 2 x 1.25 mm, Height 0.8 mm; Datasheet URL: https://datasheet.ciiva.com/29280/180495-da-01-en-chip-led-hsmg-c170-gelb-gruen-29280971.pdf; Storage Temperature Min: -40degC; LED Colour: Green; Wavelength Typ: 570nm; Mounting Type: SMD; Forward Current If Max: 20mA; Dominant Wavelength Typ: 572nm; LED Mounting: SMD; Operating Temperature Range: -30degCto+85degC; Operating Temperature Min: -30degC; Manufacturer URL: http://www.avagotech.com/; Packaging: CutTape; Luminous Intensity Typ: 15mcd; Package Reference: HSMX-C170; Storage Temperature Max: 85degC; Opto Case Style: SMD; Forward Voltage: 2.2V
J2 J3 = CMP-2000-05797-1: as J1 on sheet Power_supply; Package Description: PC Terminal Block, Pitch 6.35 mm, 1 x 2 Position, Height 21.5 mm, Tail Lenght 5.1 mm; Datasheet URL: http://media.digikey.com/pdf/Data%20Sheets/Phoenix%20Contact%20PDFs/1714955.pdf; Package Reference: 1714955; Manufacturer URL: http://www.phoenixcontact.com/; Datasheet Version: 02/2010; Mounting Technology: ThroughHole
K1 = HF46F_005-HS1: Relay: electromagnetic; SPST-NO; Ucoil: 24VDC; 5A/250VAC; 5A/30VDC; MF: Hongfa; MP: HF46F/005-HS1; SnapEDA_Link: https://www.snapeda.com/parts/HF46F/005-HS1/Hongfa/view-part/?ref=snap; Package: None; Value: *; Check_prices: https://www.snapeda.com/parts/HF46F/005-HS1/Hongfa/view-part/?ref=eda
Q3 = CMP-1138-00228-1: as Q5 on sheet Fan_driver; DatasheetVersion: Rev. 1.0; PackageReference: PG-TO263-3-2; ComponentLink1Description: Manufacturer URL; Mounting Technology: Surface Mount; PackageDescription: 3-Pin Plastic (Green) Transistor Single Outline Package, 10 x 9.25 mm Body, 2.54 mm Pitch; ComponentLink2URL: http://www.infineon.com/dgdl/IPP_B_I80P03P4-05_DS_10.pdf?folderId=db3a304314dca3890114ef902baa05f9&fileId=db3a30431ddc9372011e07ef59f52807&location=en.Products.Automotive_ICs.Automotive_MOSFETs.Single__P-Channel_30V_MOSFETs.DATASHEET.IPP_B_I80P03P4-05_DS_1; ComponentLink3Description: Package Specification; ComponentLink2Description: Datasheet; ComponentLink3URL: http://www.infineon.com/dgdl/BTS141TC_DS_10.pdf?folderId=db3a3043163797a6011667aa084c0e01&fileId=db3a3043242ebc9e01242f43f58b003e&location=en.Products.Automotive_ICs.Smart_High-_and_Low-Side_Switches.HITFET___TEMPFET__-_Smart_Low-Side_Switches.DATASHEET.BT; Halogen-free: TRUE; Technology: OptiMOS-P2; Packing: Reel; PartNumber: IPB80P03P4-05; ComponentLink1URL: http://www.infineon.com/; PackageVersion: Jul-09
Q4 = CMP-1048-00662-1: as Q6 on sheet Fan_driver; ComponentLink1URL: http://www.onsemi.com/; ComponentLink3URL: http://www.onsemi.cn/pub_link/Collateral/318-08.PDF; RoHS: TRUE; ComponentLink2Description: Datasheet; PartNumber: MMBTA42LT1G; Polarity: NPN; DatasheetVersion: Rev. 12; PackageReference: SOT-23-3-318-08; PackageDescription: 3-Pin Small Outline Transistor, Body 2.92 x 1.3 mm, Pitch 0.95 mm; ComponentLink3Description: Package Specification; ComponentLink1Description: Manufacturer URL; Packing: Tape and Reel; PackageVersion: Rev. AP, 11/2009; Mounting Technology: Surface Mount; ComponentLink2URL: http://www.onsemi.cn/pub_link/Collateral/MMBTA42LT1-D.PDF
R28 = CMP-2003-00761-1: Shunt resistor; Part Number: ERJ8BSFR10V; Manufacturer: Panasonic
R29-R42 = CMP-2001-04896-1: as R1 on sheet RS485
U7 = CMP-0704-00006-2: Zero-Drift, Bi-Directional Current / Power Monitor, 3 to 5.5 V, -40 to 125 degC, 8-pin SOIC (D8), Green (RoHS & no Sb/Br); Manufacturer: Texas Instruments; Vs(Max)(V): 5.5; Rating: Catalog; Gain(V/V): 1, 0.5, 0.25, 0.125; Vs(Min)(V): 3; Common Mode Range(Max)(V): 26; Input Offset (+/-)(Max)(uV): 100; Small-Signal Bandwidth(Typ)(MHz): 0.011; SubFamily: Current Shunt Monitor; Common Mode Range(Min)(V): 0; Quiescent Current (+/-)(Typ)(mA): 0.7; PartNumber: INA219AID; ComponentLink2Description: Datasheet; PackageVersion: 4040047-3/M, 06/2011; ComponentLink3Description: Package Specification; Mounting Technology: Surface Mount; ComponentLink2URL: http://www.ti.com/general/docs/lit/getliterature.tsp?genericPartNumber=INA219&fileType=pdf; Eco-Plan: Green (RoHS & no Sb/Br); DatasheetVersion: SBOS448F; Code_JEDEC: MS-012; PackageDescription: 8-Pin Plastic Small Outline, Body 4.9 x 3.9 mm, Pitch 1.27 mm; ComponentLink1Description: Manufacturer URL; ComponentLink1URL: http://www.ti.com/; PackageReference: D0008A; ComponentLink3URL: http://www.ti.com/lit/ml/msoi002j/msoi002j.pdf; CMRR(Min)(dB): 100

## Sheet MP9928_converter.SchDoc
size A; SheetNumber: 4; SheetTotal: 8
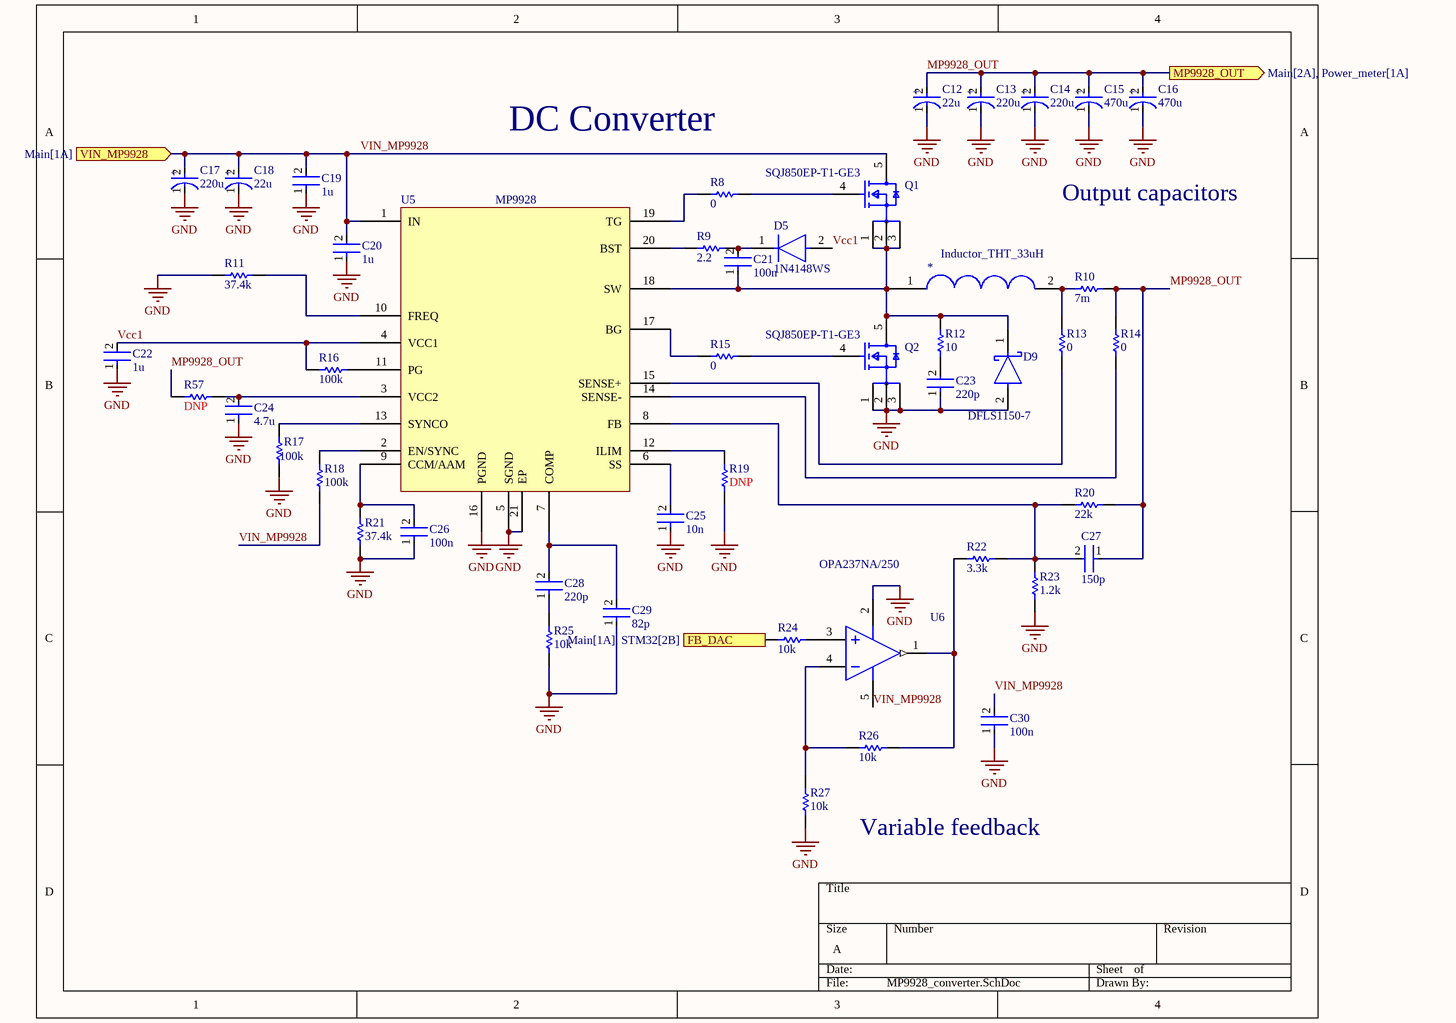
[diagram p6: MP9928_converter.SchDoc]

### Parts
*  Inductor_THT_33uH  [Inductor_THT]
C12  22u  [FP-FKG-MFG]
C13  220u  [FP-FKG-MFG]
C14  220u  [FP-FKG-MFG]
C15  470u  [FP-FKJ16-MFG]
C16  470u  [FP-FKJ16-MFG]
C17  220u  [FP-FKG-MFG]
C18  22u  [FP-FKG-MFG]
C19  1u  [FP-0805-L_2_01_0_2-W_1_25-IPC_B]
C20  1u  [FP-0805-L_2_01_0_2-W_1_25-IPC_B]
C21  100n  [FP-0805-L_2_01_0_2-W_1_25-IPC_B]
C22  1u  [FP-0805-L_2_01_0_2-W_1_25-IPC_B]
C23  220p  [FP-0805-L_2_01_0_2-W_1_25-IPC_B]
C24  4.7u  [FP-0805-L_2_01_0_2-W_1_25-IPC_B]
C25  10n  [FP-0805-L_2_01_0_2-W_1_25-IPC_B]
C26  100n  [FP-0805-L_2_01_0_2-W_1_25-IPC_B]
C27  150p  [FP-0805-L_2_01_0_2-W_1_25-IPC_B]
C28  220p  [FP-0805-L_2_01_0_2-W_1_25-IPC_B]
C29  82p  [FP-0805-L_2_01_0_2-W_1_25-IPC_B]
C30  100n  [FP-0805-L_2_01_0_2-W_1_25-IPC_B]
D5  1N4148WS  [FP-477AB-IPC_C]
D9  DFLS1150-7  [FP-PowerDI123-MFG]
Q1  SQJ850EP-T1-GE3  [FP-T16-0221-SINGLE-MFG]
Q2  SQJ850EP-T1-GE3  [FP-T16-0221-SINGLE-MFG]
R8  0  [RESC2013X50X30LL20T20]
R9  2.2  [RESC2013X50X30LL20T20]
R10  7m  [RESC3216X70X50NL05T20]
R11  37.4k  [RESC2013X50X30LL20T20]
R12  10  [RESC2013X50X30LL20T20]
R13  0  [RESC2013X50X30LL20T20]
R14  0  [RESC2013X50X30LL20T20]
R15  0  [RESC2013X50X30LL20T20]
R16  100k  [RESC2013X50X30LL20T20]
R17  100k  [RESC2013X50X30LL20T20]
R18  100k  [RESC2013X50X30LL20T20]
R19  DNP  [RESC2013X50X30LL20T20]
R20  22k  [RESC2013X50X30LL20T20]
R21  37.4k  [RESC2013X50X30LL20T20]
R22  3.3k  [RESC2013X50X30LL20T20]
R23  1.2k  [RESC2013X50X30LL20T20]
R24  10k  [RESC2013X50X30LL20T20]
R25  10k  [RESC2013X50X30LL20T20]
R26  10k  [RESC2013X50X30LL20T20]
R27  10k  [RESC2013X50X30LL20T20]
R57  DNP  [RESC2013X50X30LL20T20]
U5  MP9928  [SOP65P640X110-21N]
U6  OPA237NA/250  [DBV0005A_N]

### Ports
FB_DAC (in, see Main[1A], STM32[2B]), MP9928_OUT (out, see Main[2A], Power_meter[1A]), VIN_MP9928 (in, see Main[1A])

### Nets
GND: C12.1(C) C13.1(C) C14.1(C) C15.1(C) C16.1(C) C17.1(C) C18.1(C) C19.1 C20.1 C22.1 C23.1 C24.1 C25.1 C26.1 C29.1 C30.1 D9.2(A) Q2.1(S) Q2.2(S) Q2.3(S) R11.1 R17.2 R19.2 R21.2 R23.2 R25.2 R27.2 U5.5(SGND) U5.16(PGND) U5.21(EP) U6.2(V-)
VIN_MP9928: C17.2(A) C18.2(A) C19.2 C20.2 C30.2 Q1.5(D) R18.2 U5.1(IN) U6.5(V+) ; port VIN_MP9928
FB_DAC: R24.1 ; port FB_DAC
MP9928_OUT: C12.2(A) C13.2(A) C14.2(A) C15.2(A) C16.2(A) C27.1 R10.2 R14.1 R20.2 R57.1 ; port MP9928_OUT
Vcc1: C22.2 D5.2(A) R16.2 U5.4(VCC1)
Net*_1: *.1 C21.1 D9.1(C) Q1.1(S) Q1.2(S) Q1.3(S) Q2.5(D) R12.1 U5.18(SW)
Net*_2: *.2 R10.1 R13.1
NetC21_2: C21.2 D5.1(C) R9.1
NetC23_2: C23.2 R12.2
NetC24_2: C24.2 R57.2 U5.3(VCC2)
NetC25_2: C25.2 U5.6(SS)
NetC26_2: C26.2 R21.1 U5.9(CCM/AAM)
NetC27_2: C27.2 R20.1 R22.1 R23.1 U5.8(FB)
NetC28_1: C28.1 R25.1
NetC28_2: C28.2 C29.2 U5.7(COMP)
NetQ1_4: Q1.4(G) R8.1
NetQ2_4: Q2.4(G) R15.1
NetR8_2: R8.2 U5.19(TG)
NetR9_2: R9.2 U5.20(BST)
NetR11_2: R11.2 U5.10(FREQ)
NetR13_2: R13.2 U5.15(SENSE+)
NetR14_2: R14.2 U5.14(SENSE-)
NetR15_2: R15.2 U5.17(BG)
NetR16_1: R16.1 U5.11(PG)
NetR17_1: R17.1 U5.13(SYNCO)
NetR18_1: R18.1 U5.2(EN/SYNC)
NetR19_1: R19.1 U5.12(ILIM)
NetR22_2: R22.2 R26.2 U6.1(OUT)
NetR24_2: R24.2 U6.3(IN+)
NetR26_1: R26.1 R27.1 U6.4(IN-)

### Notes on the sheet
- DC Converter
- Output capacitors
- Variable feedback
- (in symbol CMP-05427-000014-1) +
- (in symbol CMP-05427-002167-1) +

### Library data of the parts
C12-C14 C17 C18 = CMP-05427-000014-1: CAP ALUM 220UF 20% 50V SMD; Manufacturer: Panasonic; Manufacturer Part Number: EEEFK1H221P; Material: Aluminum; Leakage Current: 110uA; Ripple Current: 670mA; Life: 2000Hours; Esr: 0.18Ω; Automotive Grade: Grade 2; Dissipation Factor: 10%; Tolerance: 20%; Device Class L3: Aluminum Electrolytic Capacitors; ComponentLink2Description: Datasheet; Temperature Range High: +105°C; Digikey Description: CAP ALUM 220UF 20% 50V SMD; Temperature: -55°C to +105°C; Temperature Range Low: -55°C; Height: 10.5mm; Voltage Rating: 50V; Value: 220uF; Capacitance: 220uF; Automotive: Yes; ComponentLink2URL: https://industrial.panasonic.com/cdbs/www-data/pdf/RDE0000/ABA0000C1181.pdf; Package: FKG; Device Class L2: Capacitors; Lead Free: Yes; Device Class L1: Passive Components; RoHS: TRUE; Mouser Description: Cap Aluminum Lytic 220uF 50V 20% (10 X 10.2mm) SMD 670mA 2000h 105C Automotive T/R; Octopart: https://octopart.com/eeefk1h221p-panasonic-1332836; Category: Cap
C15 C16 = CMP-05427-002167-1: CAP ALUM 470UF 20% 50V SMD; Impedance: 73mR; Ripple Current: 1.61A; Polarity: Polar; Life (Hours): 5000Hour; Dissipation Factor: 0.12%; Height - Seated (Max): 0.669inch; Reach SVHC Compliant: Yes; Termination: SMD/SMT; Mount: Surface Mount; Voltage: 50V; Ratings: AEC-Q200; Series: FK; Tolerance: 20%; ESR (Equivalent Series Resistance): 73mR; Construction: Cylindrical; Length: 16.5mm; Lead Free: Lead Free; Radiation Hardening: No; Package Quantity: 125; Min Operating Temperature: -55°C; Case/Package: Radial; Capacitance: 470uF; Ripple Current (AC): 1.61A; Diameter: 16mm; Voltage Rating (DC): 50V; Height: 16.5mm; Packaging: Tape and Reel; Max Operating Temperature: 105°C; Voltage Rating: 50V; RoHS Compliant: Yes
C19-C30 = CMP-2007-04174-2: as C1 on sheet RS485; Packaging: Tape and Reel; Min Operating Temperature: -55°C; Dielectric Material: Ceramic; Height: 1.4mm; Voltage Rating: 100V; Termination: SMD/SMT; Case Code (Imperial): 0805; Case Code (Metric): 2012; Case/Package: 0805; Construction: Flat; Radiation Hardening: No; Series: -; Dielectric: X7R; Package Quantity: 2000; Mount: Surface Mount; Capacitance: 100nF; Contact Plating: Tin; Voltage: 100V; Lead Free: Lead Free; Depth: 1.25mm; RoHS Compliant: Yes; Number of Pins: 2; Max Operating Temperature: 125°C; Length: 2.01mm; Voltage Rating (DC): 100V; Thickness: 0.055inch; REACH SVHC: No SVHC; Width: 0.049inch; Tolerance: 10%
D5 = CMP-07163-000040-1: DIODE GEN PURP 75V 150MA SOD323F; Forward Voltage: 1V; Power Dissipation: 200mW; Element Configuration: Single; Max Forward Surge Current (Ifsm): 2A; Peak Reverse Current: 5uA; Recovery Time: 4ns; Package Quantity: 1; Number of Pins: 2; Height: 1mm; REACH SVHC: No SVHC; Max Reverse Voltage (DC): 75V; Forward Current: 150mA; Length: 1.8mm; Max Repetitive Reverse Voltage (Vrrm): 75V; Max Operating Temperature: 150°C; Average Rectified Current: 150mA; Contact Plating: Tin; Packaging: Tape and Reel; Radiation Hardening: No; Min Operating Temperature: -55°C; Width: 1.35mm; Weight: 0.0276g; Lead Free: Lead Free; Mount: Surface Mount; Reverse Voltage: 75V; Reverse Recovery Time: 4ns
D9 = CMP-12790-000012-1: DIODE SCHOTTKY 150V POWERDI123; Manufacturer: Diodes Inc.; Max Junction Temp: +175°C; Forward Current: 1A; Capacitance: 28pF; Automotive Grade: Grade 0; Peak Reverse Current: 2uA; Value: 28pF; Max Surge Forward Current: 50A; Automotive: Yes; Package: PowerDI123; Device Class L2: Diodes; RoHS: TRUE; Footprint Url: https://www.diodes.com/assets/Package-Files/PowerDI123.pdf; Max Repetitive Reverse Voltage: 150V; ComponentLink2Description: Datasheet; Device Class L3: Schottky Diodes; Lead Free: Yes; Digikey Description: DIODE SCHOTTKY 150V POWERDI123; Height: 1mm; Manufacturer Part Number: DFLS1150-7; Mouser Description: Schottky Diodes & Rectifiers 1.0A 150V; Temperature Range Low: -55°C; Octopart: https://octopart.com/dfls1150-7-diodes+inc.-328567; ComponentLink2URL: https://www.diodes.com/assets/Datasheets/ds30593.pdf; Category: Diode; Device Class L1: Discrete Semiconductors; Temperature Range High: +175°C; Temperature: -55°C to +175°C; Reverse Voltage: 150V
Q1 Q2 = CMP-02550-000213-1: MOSFET N-CH 60V 24A; Manufacturer: Vishay; Threshold Vgs Max: 2.5V; Standoff Height: 0mm; Turn Off Delay Time: 22ns; Gate Charge At Vgs: 20nC @ 10V; Max Forward Diode Voltage: 1.2V; Max Junction Temp: +175°C; Input Capacitace At Vds: 980pF @ 30V; Pulse Drain Current: 96A; Rthja Max: 70°C/W; Gate To Source Voltage: 20V; Threshold Vgs Min: 1.5V; Drain To Source Resistance: 0.019Ω; Automotive Grade: Grade 0; Typ Forward Diode Voltage: 0.8V; Transconductance: 29S; Depletion Mode: False; Turn On Delay Time: 21ns; Number Of Channels: 1; Power Dissipation: 45W; Category: Trans; Octopart: https://octopart.com/sqj850ep-t1_ge3-vishay-63675376; Device Class L3: MOSFETs; Digikey Description: MOSFET N-CH 60V 24A; Continuous Drain Current: 24A; ComponentLink2Description: Datasheet; Mouser Description: MOSFET 60V 24A 45W N-Ch Automotive; ComponentLink2URL: http://www.vishay.com/docs/65280/sqj850ep.pdf; Device Class L1: Discrete Semiconductors; Device Class L2: Transistors; Package: T16-0221-SINGLE; Temperature Range Low: -55°C; RoHS: TRUE; Drain To Source Breakdown Voltage: 60V; Manufacturer Part Number: SQJ850EP-T1-GE3; Lead Free: Yes; Drain To Source Voltage: 60V; Temperature: -55°C to +175°C; Automotive: Yes; Temperature Range High: +175°C; Height: 1.267mm; Number Of N Channels: 1
R8 R9 R11-R27 R57 = CMP-2001-04896-1: as R1 on sheet RS485
R10 = CMP-2003-00761-1: as R28 on sheet Power_meter
U6 = CMP-0272-00854-3: Single-Supply Operational Amplifier MicroAmplifier(TM) Series, 2.7 to 36 V, -55 to 125 degC, 5-pin SOT23 (DBV5), Green (RoHS & no Sb/Br); Manufacturer: Texas Instruments; Total Supply Voltage(Max)(+5V is 5, +/-5V is 10): 36; Packing: SMALL T&R; CMRR(Min)(dB): 78; Vio (25C)(Max)(mV): 0.75; Total Supply Voltage(Min)(+5V is 5, +/-5V is 10): 2.7; Rating: Catalog; Slew Rate(Typ)(V/us): 0.5; Number of Channels: 1; GBW(Typ)(MHz): 1.4; Sub Family: High Supply Voltage Amplifier (>=30V), Low Power Amp (<=500uA), Low Supply Voltage Amplifier (<=2.7V), Precision Amplifier; IIB(Max)(pA): 40000; Iq per channel(Max)(mA): 0.35; Offset Drift(Typ)(uV/C): 2; DatasheetVersion: SBOS057A; PackageVersion: 4073253-4/K, 03/2006; ComponentLink1URL: http://www.ti.com/; ComponentLink2Description: Datasheet; ComponentLink3Description: Package Specification; PackageReference: DBV0005A; Mounting Technology: Surface Mount; ComponentLink3URL: http://www.ti.com/litv/pdf/mpds018i; PartNumber: OPA237NA/250; Eco-Plan: Green (RoHS & no Sb/Br); ComponentLink1Description: Manufacturer URL; PackageDescription: 5-Pin Plastic Small Outline, Body 1.6 x 2.9 mm, Pitch 0.95 mm; ComponentLink2URL: http://www.ti.com/lit/ds/symlink/opa237.pdf; Code_JEDEC: MO-178

## Sheet STM32.SchDoc
size A; SheetNumber: 6; SheetTotal: 8
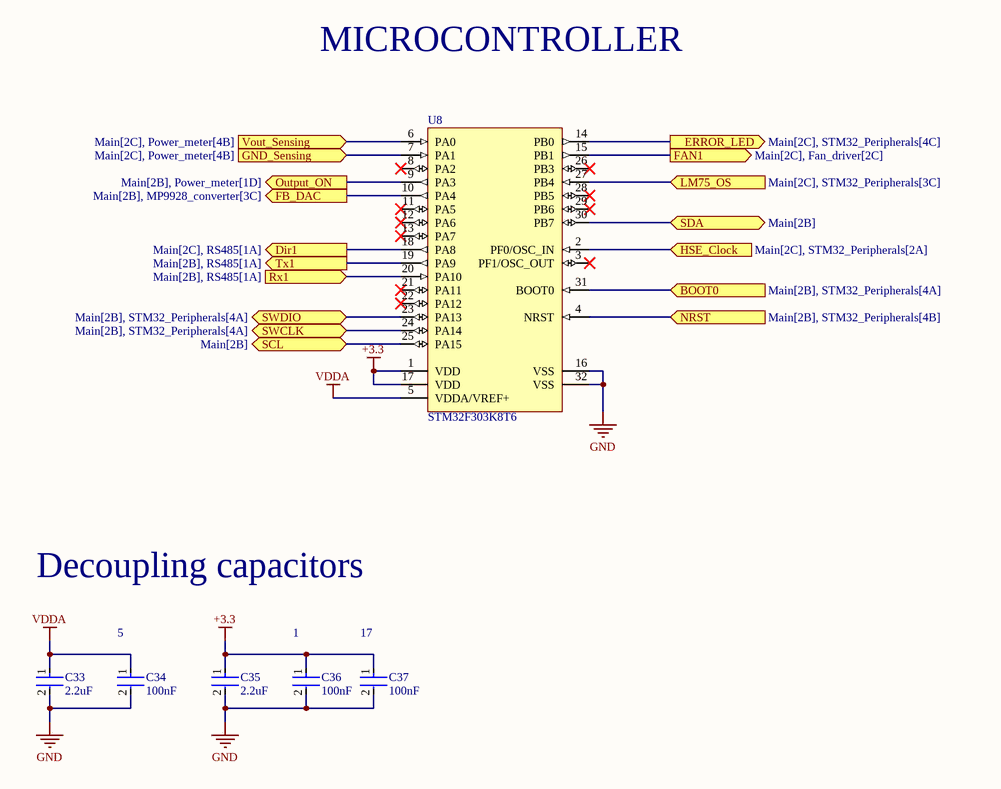
[diagram p7: STM32.SchDoc]

### Parts
C33  2.2uF  [FP-0805-L_2_01_0_2-W_1_25-IPC_B]
C34  100nF  [FP-CGA3E-0_3-0_1-IPC_A]
C35  2.2uF  [FP-0805-L_2_01_0_2-W_1_25-IPC_B]
C36  100nF  [FP-CGA3E-0_3-0_1-IPC_A]
C37  100nF  [FP-CGA3E-0_3-0_1-IPC_A]
U8  STM32F303K8T6  [STM-LQFP32_M]

### Ports
BOOT0 (in, see Main[2B], STM32_Peripherals[4A]), Dir1 (out, see Main[2C], RS485[1A]), ERROR_LED (out, see Main[2C], STM32_Peripherals[4C]), FAN1 (out, see Main[2C], Fan_driver[2C]), FB_DAC (out, see Main[2B], MP9928_converter[3C]), GND_Sensing (in, see Main[2C], Power_meter[4B]), HSE_Clock (in, see Main[2C], STM32_Peripherals[2A]), LM75_OS (in, see Main[2C], STM32_Peripherals[3C]), NRST (in, see Main[2B], STM32_Peripherals[4B]), Output_ON (out, see Main[2B], Power_meter[1D]), Rx1 (in, see Main[2B], RS485[1A]), SCL (bidir, see Main[2B]), SDA (bidir, see Main[2B]), SWCLK (bidir, see Main[2B], STM32_Peripherals[4A]), SWDIO (bidir, see Main[2B], STM32_Peripherals[4A]), Tx1 (out, see Main[2B], RS485[1A]), Vout_Sensing (in, see Main[2C], Power_meter[4B])

### Nets
+3.3: C35.1 C36.1 C37.1 U8.1(VDD) U8.17(VDD)
GND: C33.2 C34.2 C35.2 C36.2 C37.2 U8.16(VSS) U8.32(VSS)
VDDA: C33.1 C34.1 U8.5(VDDA/VREF+)
BOOT0: U8.31(BOOT0) ; port BOOT0
Dir1: U8.18(PA8) ; port Dir1
ERROR_LED: U8.14(PB0) ; port ERROR_LED
FAN1: U8.15(PB1) ; port FAN1
FB_DAC: U8.10(PA4) ; port FB_DAC
GND_Sensing: U8.7(PA1) ; port GND_Sensing
HSE_Clock: U8.2(PF0/OSC_IN) ; port HSE_Clock
LM75_OS: U8.27(PB4) ; port LM75_OS
NRST: U8.4(NRST) ; port NRST
Output_ON: U8.9(PA3) ; port Output_ON
Rx1: U8.20(PA10) ; port Rx1
SCL: U8.25(PA15) ; port SCL
SDA: U8.30(PB7) ; port SDA
SWCLK: U8.24(PA14) ; port SWCLK
SWDIO: U8.23(PA13) ; port SWDIO
Tx1: U8.19(PA9) ; port Tx1
Vout_Sensing: U8.6(PA0) ; port Vout_Sensing

Not connected (* = marked no-connect by the designer): U8 3(PF1/OSC_OUT)* 8(PA2)* 11(PA5)* 12(PA6)* 13(PA7)* 21(PA11)* 22(PA12)* 26(PB3)* 28(PB5)* 29(PB6)*

### Notes on the sheet
- MICROCONTROLLER
- Decoupling capacitors
- (near C34) 5
- (near C36) 1
- (near C37) 17

### Library data of the parts
C33 C35 = CMP-2007-04174-2: as C38 on sheet STM32_Peripherals; Packaging: Tape and Reel; Min Operating Temperature: -55°C; Dielectric Material: Ceramic; Height: 1.4mm; Voltage Rating: 100V; Termination: SMD/SMT; Case Code (Imperial): 0805; Case Code (Metric): 2012; Case/Package: 0805; Construction: Flat; Radiation Hardening: No; Series: -; Dielectric: X7R; Package Quantity: 2000; Mount: Surface Mount; Contact Plating: Tin; Voltage: 100V; Lead Free: Lead Free; Depth: 1.25mm; RoHS Compliant: Yes; Number of Pins: 2; Max Operating Temperature: 125°C; Length: 2.01mm; Voltage Rating (DC): 100V; Thickness: 0.055inch; REACH SVHC: No SVHC; Width: 0.049inch; Tolerance: 10%
C34 C36 C37 = CMP-2000-07546-2: Cap Ceramic 100nF 50V X7R 10% Pad SMD 0603 +125°C Automotive T/R; Weight: 7.1E-05oz; Composition: Ceramic; Max Operating Temperature: 125°C; Termination: SMD/SMT; Dielectric: X7R; Length: 1.6mm; Package Quantity: 1; REACH SVHC: No SVHC; Lead Free: Lead Free; Case Code (Metric): 1608; Min Operating Temperature: -55°C; Packaging: Tape and Reel; Tolerance: 10%; Voltage Rating: 50V; Case Code (Imperial): 0603; Capacitance: 100nF; Case/Package: 0603; Voltage Rating (DC): 50V; Depth: 0.8mm; Radiation Hardening: No; Ratings: AEC-Q200; Mount: Surface Mount; Voltage: 50V; Thickness: 0.035inch; Width: 0.8mm; Height: 0.8mm
U8 = CMP-0537-00040-1: ARM Cortex-M4 32-bit MCU, 64 KB Flash, 16 KB Internal RAM, 25 I/Os, 32-Pin LQFP, -40 to 85 degC, Tray; Supply Voltage(Vcc) min (V): 2; Internal RAM Size (kB): 16; D/A Converter: 3; FLASH Size (Prog) (kB): 64; I/Os (High Current): 25; Operating Frequency(F) (Processor speed) (MHz): 72; ComponentLink1URL: http://www.st.com/; Package Description: 32-Pin Low Profile Quad Flat Package, 7 x 7 mm Body, 0.8 mm Pitch; Mounting Technology: Surface Mount; ComponentLink2Description: Datasheet; ComponentLink2URL: http://www.st.com/st-web-ui/static/active/en/resource/technical/document/datasheet/DM00092070.pdf; Core: ARM Cortex-M4; ComponentLink1Description: Manufacturer URL; Package Reference: LQFP32; Packing: Tray; DatasheetVersion: Rev. 4

## Nets that join several sheets
+3.3: RS485 (C1.1 D1.2 R1.2 U1.8), Power_supply (C11.2 R7.2 U4.2 U4.4), STM32_Peripherals (10 pins), Power_meter (C32.2 R31.2 R32.2 U7.5), STM32 (5 pins)
GND: RS485 (5 pins), Power_supply (18 pins), Fan_driver (5 pins), STM32_Peripherals (7 pins), Power_meter (13 pins), MP9928_converter (31 pins), STM32 (7 pins)
VDDA: Power_supply (C9.2 R56.2 U3.6), STM32 (C33.1 C34.1 U8.5)
VIN_MP9928: Power_supply (6 pins), Fan_driver (Q5.3 R43.2), Power_meter (Q3.3 R38.2), MP9928_converter (9 pins)
BOOT0: STM32_Peripherals (J6.5), STM32 (U8.31)
Dir1: RS485 (U1.2 U1.3), STM32 (U8.18)
ERROR_LED: STM32_Peripherals (R55.2), STM32 (U8.14)
FAN1: Fan_driver (R46.1), STM32 (U8.15)
FB_DAC: MP9928_converter (R24.1), STM32 (U8.10)
GND_Sensing: Power_meter (R35.1), STM32 (U8.7)
HSE_Clock: STM32_Peripherals (R49.2), STM32 (U8.2)
LM75_OS: STM32_Peripherals (R54.1 U9.3), STM32 (U8.27)
MP9928_OUT: Power_meter (R28.1 R29.2), MP9928_converter (10 pins)
NRST: STM32_Peripherals (J6.2), STM32 (U8.4)
Output_ON: Power_meter (R41.1), STM32 (U8.9)
Rx1: RS485 (U1.1), STM32 (U8.20)
SCL: STM32_Peripherals (R52.1 U9.2), Power_meter (R31.1 U7.4), STM32 (U8.25)
SDA: STM32_Peripherals (R53.1 U9.1), Power_meter (R32.1 U7.3), STM32 (U8.30)
SWCLK: STM32_Peripherals (J6.1), STM32 (U8.24)
SWDIO: STM32_Peripherals (J6.3), STM32 (U8.23)
Tx1: RS485 (U1.4), STM32 (U8.19)
Vout_Sensing: Power_meter (R36.2 R37.1), STM32 (U8.6)